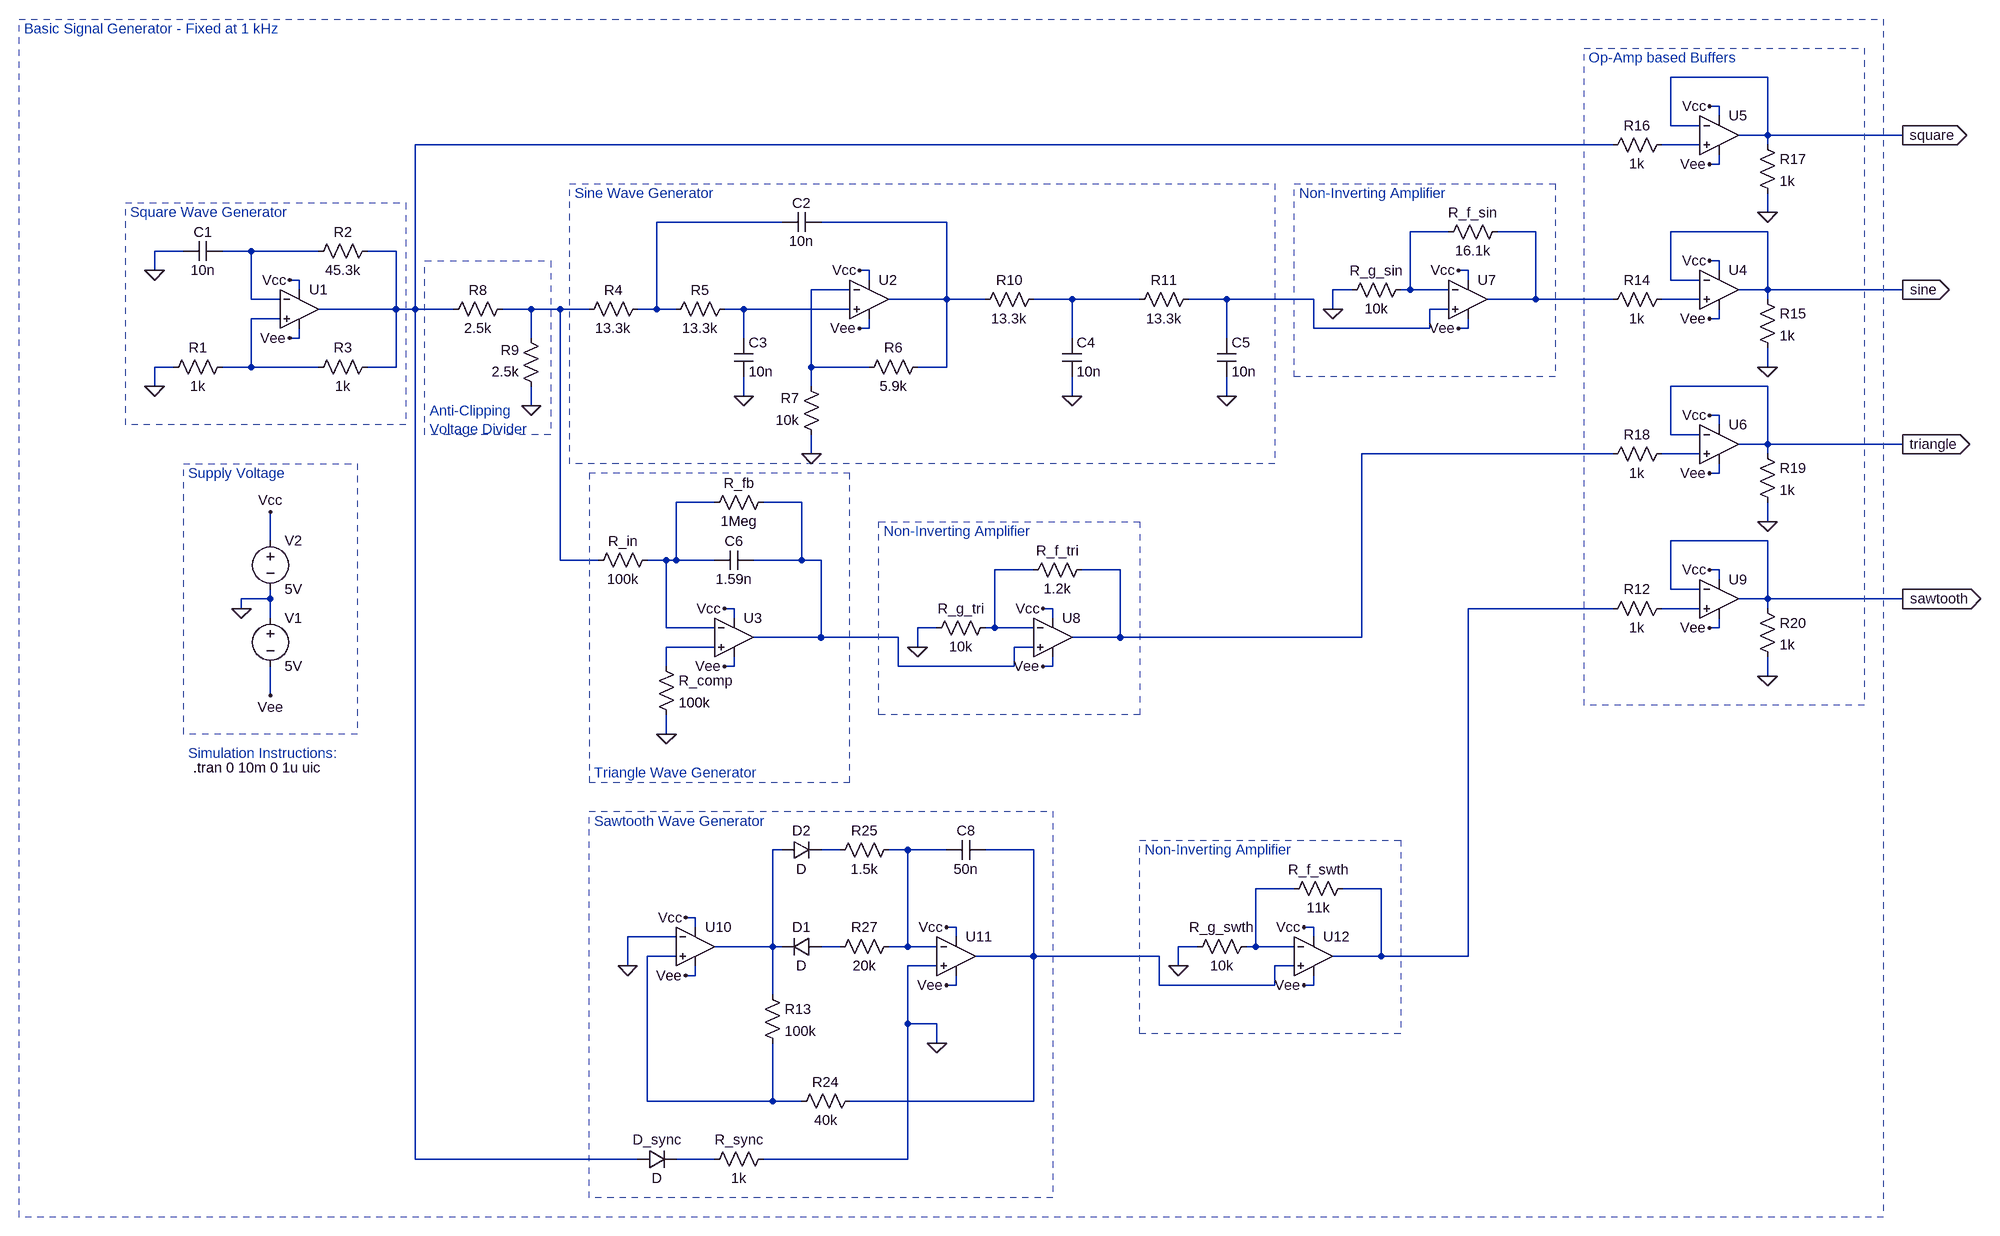
[diagram p0: schematic multi-wave-osc.asc]
multi-wave-osc.asc, the LTspice schematic file:
Version 4
SHEET 1 3000 2516
WIRE 2608 -192 2448 -192
WIRE 2528 -144 2512 -144
WIRE 2528 -128 2528 -144
WIRE 2448 -112 2448 -192
WIRE 2496 -112 2448 -112
WIRE 2608 -96 2608 -192
WIRE 2608 -96 2560 -96
WIRE 2832 -96 2608 -96
WIRE 2352 -80 368 -80
WIRE 2496 -80 2432 -80
WIRE 2608 -80 2608 -96
WIRE 2528 -48 2528 -64
WIRE 2528 -48 2512 -48
WIRE 2608 32 2608 0
WIRE 976 48 768 48
WIRE 1248 48 1040 48
WIRE 2080 64 2016 64
WIRE 2224 64 2160 64
WIRE 2608 64 2448 64
WIRE -16 96 -64 96
WIRE 96 96 48 96
WIRE 208 96 96 96
WIRE 336 96 288 96
WIRE 2528 112 2512 112
WIRE -64 128 -64 96
WIRE 1120 128 1104 128
WIRE 2112 128 2096 128
WIRE 2528 128 2528 112
WIRE 176 144 160 144
WIRE 1120 144 1120 128
WIRE 2112 144 2112 128
WIRE 2448 144 2448 64
WIRE 2496 144 2448 144
WIRE 176 160 176 144
WIRE 1088 160 1024 160
WIRE 1920 160 1888 160
WIRE 2016 160 2016 64
WIRE 2016 160 2000 160
WIRE 2080 160 2016 160
WIRE 2608 160 2608 64
WIRE 2608 160 2560 160
WIRE 2832 160 2608 160
WIRE 96 176 96 96
WIRE 144 176 96 176
WIRE 1248 176 1248 48
WIRE 1248 176 1152 176
WIRE 1312 176 1248 176
WIRE 1456 176 1392 176
WIRE 1568 176 1456 176
WIRE 1712 176 1648 176
WIRE 1856 176 1712 176
WIRE 2224 176 2224 64
WIRE 2224 176 2144 176
WIRE 2352 176 2224 176
WIRE 2496 176 2432 176
WIRE 2608 176 2608 160
WIRE 336 192 336 96
WIRE 336 192 208 192
WIRE 368 192 368 -80
WIRE 368 192 336 192
WIRE 432 192 368 192
WIRE 560 192 512 192
WIRE 608 192 560 192
WIRE 656 192 608 192
WIRE 768 192 768 48
WIRE 768 192 736 192
WIRE 800 192 768 192
WIRE 912 192 880 192
WIRE 1088 192 912 192
WIRE 1888 192 1888 160
WIRE 2080 192 2048 192
WIRE 144 208 96 208
WIRE 2528 208 2528 192
WIRE 2528 208 2512 208
WIRE 1120 224 1120 208
WIRE 1120 224 1104 224
WIRE 1856 224 1856 176
WIRE 2048 224 2048 192
WIRE 2048 224 1856 224
WIRE 2112 224 2112 208
WIRE 2112 224 2096 224
WIRE 176 240 176 224
WIRE 176 240 160 240
WIRE 560 240 560 192
WIRE 912 240 912 192
WIRE 1456 240 1456 176
WIRE 1712 240 1712 176
WIRE -32 288 -64 288
WIRE 96 288 96 208
WIRE 96 288 48 288
WIRE 208 288 96 288
WIRE 336 288 336 192
WIRE 336 288 288 288
WIRE 1024 288 1024 160
WIRE 1120 288 1024 288
WIRE 1248 288 1248 176
WIRE 1248 288 1200 288
WIRE 2608 288 2608 256
WIRE -64 320 -64 288
WIRE 1024 320 1024 288
WIRE 2608 320 2448 320
WIRE 912 336 912 304
WIRE 1456 336 1456 304
WIRE 1712 336 1712 304
WIRE 560 352 560 320
WIRE 2528 368 2512 368
WIRE 2528 384 2528 368
WIRE 2448 400 2448 320
WIRE 2496 400 2448 400
WIRE 2608 416 2608 320
WIRE 2608 416 2560 416
WIRE 2832 416 2608 416
WIRE 1024 432 1024 400
WIRE 2352 432 1936 432
WIRE 2496 432 2432 432
WIRE 2608 432 2608 416
WIRE 2528 464 2528 448
WIRE 2528 464 2512 464
WIRE 864 512 800 512
WIRE 1008 512 944 512
WIRE 2608 544 2608 512
WIRE 128 576 128 528
WIRE 2608 576 2448 576
WIRE 608 608 608 192
WIRE 672 608 608 608
WIRE 784 608 752 608
WIRE 800 608 800 512
WIRE 800 608 784 608
WIRE 864 608 800 608
WIRE 1008 608 1008 512
WIRE 1008 608 928 608
WIRE 1040 608 1008 608
WIRE 1392 624 1328 624
WIRE 1536 624 1472 624
WIRE 2528 624 2512 624
WIRE 2528 640 2528 624
WIRE 2448 656 2448 576
WIRE 2496 656 2448 656
WIRE 128 672 128 656
WIRE 128 672 80 672
WIRE 2608 672 2608 576
WIRE 2608 672 2560 672
WIRE 2832 672 2608 672
WIRE 80 688 80 672
WIRE 896 688 880 688
WIRE 1424 688 1408 688
WIRE 2352 688 2112 688
WIRE 2496 688 2432 688
WIRE 2608 688 2608 672
WIRE 128 704 128 672
WIRE 896 704 896 688
WIRE 1424 704 1424 688
WIRE 784 720 784 608
WIRE 864 720 784 720
WIRE 1232 720 1200 720
WIRE 1328 720 1328 624
WIRE 1328 720 1312 720
WIRE 1392 720 1328 720
WIRE 2528 720 2528 704
WIRE 2528 720 2512 720
WIRE 1040 736 1040 608
WIRE 1040 736 928 736
WIRE 1168 736 1040 736
WIRE 1536 736 1536 624
WIRE 1536 736 1456 736
WIRE 1936 736 1936 432
WIRE 1936 736 1536 736
WIRE 864 752 784 752
WIRE 1200 752 1200 720
WIRE 1392 752 1360 752
WIRE 784 784 784 752
WIRE 896 784 896 768
WIRE 896 784 880 784
WIRE 1168 784 1168 736
WIRE 1360 784 1360 752
WIRE 1360 784 1168 784
WIRE 1424 784 1424 768
WIRE 1424 784 1408 784
WIRE 2608 800 2608 768
WIRE 128 832 128 784
WIRE 784 896 784 864
WIRE 976 1088 960 1088
WIRE 1072 1088 1040 1088
WIRE 1184 1088 1152 1088
WIRE 1248 1088 1184 1088
WIRE 1392 1088 1312 1088
WIRE 1824 1152 1760 1152
WIRE 1968 1152 1904 1152
WIRE 832 1200 816 1200
WIRE 832 1216 832 1200
WIRE 1264 1216 1248 1216
WIRE 1856 1216 1840 1216
WIRE 800 1232 720 1232
WIRE 1264 1232 1264 1216
WIRE 1856 1232 1856 1216
WIRE 960 1248 960 1088
WIRE 960 1248 864 1248
WIRE 976 1248 960 1248
WIRE 1072 1248 1040 1248
WIRE 1184 1248 1184 1088
WIRE 1184 1248 1152 1248
WIRE 1232 1248 1184 1248
WIRE 1664 1248 1632 1248
WIRE 1760 1248 1760 1152
WIRE 1760 1248 1744 1248
WIRE 1824 1248 1760 1248
WIRE 800 1264 752 1264
WIRE 1392 1264 1392 1088
WIRE 1392 1264 1296 1264
WIRE 1600 1264 1392 1264
WIRE 1968 1264 1968 1152
WIRE 1968 1264 1888 1264
WIRE 2112 1264 2112 688
WIRE 2112 1264 1968 1264
WIRE 720 1280 720 1232
WIRE 1232 1280 1184 1280
WIRE 1632 1280 1632 1248
WIRE 1824 1280 1792 1280
WIRE 832 1296 832 1280
WIRE 832 1296 816 1296
WIRE 1264 1312 1264 1296
WIRE 1264 1312 1248 1312
WIRE 1600 1312 1600 1264
WIRE 1792 1312 1792 1280
WIRE 1792 1312 1600 1312
WIRE 1856 1312 1856 1296
WIRE 1856 1312 1840 1312
WIRE 960 1328 960 1248
WIRE 1184 1376 1184 1280
WIRE 1232 1376 1184 1376
WIRE 1232 1408 1232 1376
WIRE 752 1504 752 1264
WIRE 960 1504 960 1408
WIRE 960 1504 752 1504
WIRE 1008 1504 960 1504
WIRE 1392 1504 1392 1264
WIRE 1392 1504 1088 1504
WIRE 368 1600 368 192
WIRE 736 1600 368 1600
WIRE 864 1600 800 1600
WIRE 1184 1600 1184 1376
WIRE 1184 1600 944 1600
FLAG -64 128 0
FLAG -64 320 0
FLAG 80 688 0
FLAG 2832 -96 square
IOPIN 2832 -96 Out
FLAG 128 528 Vcc
FLAG 128 832 Vee
FLAG 160 144 Vcc
FLAG 160 240 Vee
FLAG 1104 128 Vcc
FLAG 1104 224 Vee
FLAG 1024 432 0
FLAG 912 336 0
FLAG 2832 160 sine
IOPIN 2832 160 Out
FLAG 560 352 0
FLAG 1456 336 0
FLAG 1712 336 0
FLAG 2832 416 triangle
IOPIN 2832 416 Out
FLAG 880 688 Vcc
FLAG 880 784 Vee
FLAG 2512 112 Vcc
FLAG 2512 208 Vee
FLAG 2608 288 0
FLAG 2512 -144 Vcc
FLAG 2512 -48 Vee
FLAG 2608 32 0
FLAG 2512 368 Vcc
FLAG 2512 464 Vee
FLAG 2608 544 0
FLAG 2096 128 Vcc
FLAG 2096 224 Vee
FLAG 1888 192 0
FLAG 784 896 0
FLAG 1408 688 Vcc
FLAG 1408 784 Vee
FLAG 1200 752 0
FLAG 816 1200 Vcc
FLAG 816 1296 Vee
FLAG 1248 1216 Vcc
FLAG 1248 1312 Vee
FLAG 2512 624 Vcc
FLAG 2512 720 Vee
FLAG 2608 800 0
FLAG 2832 672 sawtooth
IOPIN 2832 672 Out
FLAG 1840 1216 Vcc
FLAG 1840 1312 Vee
FLAG 1632 1280 0
FLAG 720 1280 0
FLAG 1232 1408 0
SYMBOL OpAmps\\UniversalOpamp2 176 192 R0
SYMATTR InstName U1
SYMBOL cap 48 80 R90
WINDOW 0 0 32 VBottom 2
WINDOW 3 32 32 VTop 2
SYMATTR InstName C1
SYMATTR Value 10n
SYMBOL res 64 272 R90
WINDOW 0 0 56 VBottom 2
WINDOW 3 32 56 VTop 2
SYMATTR InstName R1
SYMATTR Value 1k
SYMBOL res 304 80 R90
WINDOW 0 0 56 VBottom 2
WINDOW 3 32 56 VTop 2
SYMATTR InstName R2
SYMATTR Value 45.3k
SYMBOL res 304 272 R90
WINDOW 0 0 56 VBottom 2
WINDOW 3 32 56 VTop 2
SYMATTR InstName R3
SYMATTR Value 1k
SYMBOL voltage 128 688 R0
WINDOW 123 0 0 Left 0
WINDOW 39 0 0 Left 0
SYMATTR InstName V1
SYMATTR Value 5V
SYMBOL voltage 128 560 R0
WINDOW 123 0 0 Left 0
WINDOW 39 0 0 Left 0
SYMATTR InstName V2
SYMATTR Value 5V
SYMBOL OpAmps\\UniversalOpamp2 1120 176 R0
SYMATTR InstName U2
SYMBOL res 1216 272 R90
WINDOW 0 0 56 VBottom 2
WINDOW 3 32 56 VTop 2
SYMATTR InstName R6
SYMATTR Value 5.9k
SYMBOL res 1040 416 R180
WINDOW 0 36 76 Left 2
WINDOW 3 36 40 Left 2
SYMATTR InstName R7
SYMATTR Value 10k
SYMBOL cap 1040 32 R90
WINDOW 0 0 32 VBottom 2
WINDOW 3 32 32 VTop 2
SYMATTR InstName C2
SYMATTR Value 10n
SYMBOL cap 896 240 R0
SYMATTR InstName C3
SYMATTR Value 10n
SYMBOL res 896 176 R90
WINDOW 0 0 56 VBottom 2
WINDOW 3 32 56 VTop 2
SYMATTR InstName R5
SYMATTR Value 13.3k
SYMBOL res 752 176 R90
WINDOW 0 0 56 VBottom 2
WINDOW 3 32 56 VTop 2
SYMATTR InstName R4
SYMATTR Value 13.3k
SYMBOL res 528 176 R90
WINDOW 0 0 56 VBottom 2
WINDOW 3 32 56 VTop 2
SYMATTR InstName R8
SYMATTR Value 2.5k
SYMBOL res 576 336 R180
WINDOW 0 36 76 Left 2
WINDOW 3 36 40 Left 2
SYMATTR InstName R9
SYMATTR Value 2.5k
SYMBOL res 1408 160 R90
WINDOW 0 0 56 VBottom 2
WINDOW 3 32 56 VTop 2
SYMATTR InstName R10
SYMATTR Value 13.3k
SYMBOL cap 1440 240 R0
SYMATTR InstName C4
SYMATTR Value 10n
SYMBOL res 1664 160 R90
WINDOW 0 0 56 VBottom 2
WINDOW 3 32 56 VTop 2
SYMATTR InstName R11
SYMATTR Value 13.3k
SYMBOL cap 1696 240 R0
SYMATTR InstName C5
SYMATTR Value 10n
SYMBOL res 768 592 R90
WINDOW 0 0 56 VBottom 2
WINDOW 3 32 56 VTop 2
SYMATTR InstName R_in
SYMATTR Value 100k
SYMBOL cap 928 592 R90
WINDOW 0 0 32 VBottom 2
WINDOW 3 32 32 VTop 2
SYMATTR InstName C6
SYMATTR Value 1.59n
SYMBOL res 960 496 R90
WINDOW 0 0 56 VBottom 2
WINDOW 3 32 56 VTop 2
SYMATTR InstName R_fb
SYMATTR Value 1Meg
SYMBOL OpAmps\\UniversalOpamp2 896 736 R0
SYMATTR InstName U3
SYMBOL OpAmps\\UniversalOpamp2 2528 160 R0
SYMATTR InstName U4
SYMBOL res 2448 160 R90
WINDOW 0 0 56 VBottom 2
WINDOW 3 32 56 VTop 2
SYMATTR InstName R14
SYMATTR Value 1k
SYMBOL res 2592 160 R0
SYMATTR InstName R15
SYMATTR Value 1k
SYMBOL OpAmps\\UniversalOpamp2 2528 -96 R0
SYMATTR InstName U5
SYMBOL res 2448 -96 R90
WINDOW 0 0 56 VBottom 2
WINDOW 3 32 56 VTop 2
SYMATTR InstName R16
SYMATTR Value 1k
SYMBOL res 2592 -96 R0
SYMATTR InstName R17
SYMATTR Value 1k
SYMBOL OpAmps\\UniversalOpamp2 2528 416 R0
SYMATTR InstName U6
SYMBOL res 2448 416 R90
WINDOW 0 0 56 VBottom 2
WINDOW 3 32 56 VTop 2
SYMATTR InstName R18
SYMATTR Value 1k
SYMBOL res 2592 416 R0
SYMATTR InstName R19
SYMATTR Value 1k
SYMBOL OpAmps\\UniversalOpamp2 2112 176 R0
SYMATTR InstName U7
SYMBOL res 2176 48 R90
WINDOW 0 0 56 VBottom 2
WINDOW 3 32 56 VTop 2
SYMATTR InstName R_f_sin
SYMATTR Value 16.1k
SYMBOL res 2016 144 R90
WINDOW 0 0 56 VBottom 2
WINDOW 3 32 56 VTop 2
SYMATTR InstName R_g_sin
SYMATTR Value 10k
SYMBOL res 768 768 R0
SYMATTR InstName R_comp
SYMATTR Value 100k
SYMBOL OpAmps\\UniversalOpamp2 1424 736 R0
SYMATTR InstName U8
SYMBOL res 1488 608 R90
WINDOW 0 0 56 VBottom 2
WINDOW 3 32 56 VTop 2
SYMATTR InstName R_f_tri
SYMATTR Value 1.2k
SYMBOL res 1328 704 R90
WINDOW 0 0 56 VBottom 2
WINDOW 3 32 56 VTop 2
SYMATTR InstName R_g_tri
SYMATTR Value 10k
SYMBOL OpAmps\\UniversalOpamp2 832 1248 R0
SYMATTR InstName U10
SYMBOL OpAmps\\UniversalOpamp2 1264 1264 R0
SYMATTR InstName U11
SYMBOL diode 1040 1232 R90
WINDOW 0 0 32 VBottom 2
WINDOW 3 32 32 VTop 2
SYMATTR InstName D1
SYMBOL diode 976 1104 R270
WINDOW 0 32 32 VTop 2
WINDOW 3 0 32 VBottom 2
SYMATTR InstName D2
SYMBOL res 1168 1072 R90
WINDOW 0 0 56 VBottom 2
WINDOW 3 32 56 VTop 2
SYMATTR InstName R25
SYMATTR Value 1.5k
SYMBOL res 1168 1232 R90
WINDOW 0 0 56 VBottom 2
WINDOW 3 32 56 VTop 2
SYMATTR InstName R27
SYMATTR Value 20k
SYMBOL cap 1312 1072 R90
WINDOW 0 0 32 VBottom 2
WINDOW 3 32 32 VTop 2
SYMATTR InstName C8
SYMATTR Value 50n
SYMBOL res 944 1312 R0
SYMATTR InstName R13
SYMATTR Value 100k
SYMBOL res 1104 1488 R90
WINDOW 0 0 56 VBottom 2
WINDOW 3 32 56 VTop 2
SYMATTR InstName R24
SYMATTR Value 40k
SYMBOL OpAmps\\UniversalOpamp2 2528 672 R0
SYMATTR InstName U9
SYMBOL res 2448 672 R90
WINDOW 0 0 56 VBottom 2
WINDOW 3 32 56 VTop 2
SYMATTR InstName R12
SYMATTR Value 1k
SYMBOL res 2592 672 R0
SYMATTR InstName R20
SYMATTR Value 1k
SYMBOL OpAmps\\UniversalOpamp2 1856 1264 R0
SYMATTR InstName U12
SYMBOL res 1920 1136 R90
WINDOW 0 0 56 VBottom 2
WINDOW 3 32 56 VTop 2
SYMATTR InstName R_f_swth
SYMATTR Value 11k
SYMBOL res 1760 1232 R90
WINDOW 0 0 56 VBottom 2
WINDOW 3 32 56 VTop 2
SYMATTR InstName R_g_swth
SYMATTR Value 10k
SYMBOL res 960 1584 R90
WINDOW 0 0 56 VBottom 2
WINDOW 3 32 56 VTop 2
SYMATTR InstName R_sync
SYMATTR Value 1k
SYMBOL diode 736 1616 R270
WINDOW 0 32 32 VTop 2
WINDOW 3 0 32 VBottom 2
SYMATTR InstName D_sync
TEXT 0 952 Left 2 !.tran 0 10m 0 1u uic
TEXT -104 32 Left 2 ;Square Wave Generator
TEXT 632 0 Left 2 ;Sine Wave Generator
TEXT 664 960 Left 2 ;Triangle Wave Generator
TEXT 2312 -224 Left 2 ;Op-Amp based Buffers
TEXT 392 360 Left 2 ;Anti-Clipping \nVoltage Divider
TEXT 1832 0 Left 2 ;Non-Inverting Amplifier
TEXT 1144 560 Left 2 ;Non-Inverting Amplifier
TEXT 1576 1088 Left 2 ;Non-Inverting Amplifier
TEXT 664 1040 Left 2 ;Sawtooth Wave Generator
TEXT -280 -272 Left 2 ;Basic Signal Generator - Fixed at 1 kHz
TEXT -8 464 Left 2 ;Supply Voltage
TEXT -8 928 Left 2 ;Simulation Instructions:
RECTANGLE Normal 352 384 -112 16 2
RECTANGLE Normal 2256 304 1824 -16 2
RECTANGLE Normal 656 976 1088 464 2
RECTANGLE Normal 1568 864 1136 544 2
RECTANGLE Normal 2768 848 2304 -240 2
RECTANGLE Normal 2000 1392 1568 1072 2
RECTANGLE Normal 272 896 -16 448 2
RECTANGLE Normal 1792 448 624 -16 2
RECTANGLE Normal 592 400 384 112 2
RECTANGLE Normal 1424 1664 656 1024 2
RECTANGLE Normal 2800 1696 -288 -288 2

The netlist it stands for:
* multi-wave-osc.asc
XU1 N014 N007 Vcc Vee N001 level.2 Avol=1Meg GBW=10Meg Slew=10Meg ilimit=25m rail=0 Vos=0 phimargin=45 en=0 enk=0 in=0 ink=0 Rin=500Meg  ; pins IN+ IN- V+ V- OUT
C1 N007 0 10n
R1 N014 0 1k
R2 N001 N007 45.3k
R3 N001 N014 1k
V1 0 Vee 5V
V2 Vcc 0 5V
XU2 N013 N008 Vcc Vee N004 level.2 Avol=1Meg GBW=10Meg Slew=10Meg ilimit=25m rail=0 Vos=0 phimargin=45 en=0 enk=0 in=0 ink=0 Rin=500Meg  ; pins IN+ IN- V+ V- OUT
R6 N004 N008 5.9k
R7 0 N008 10k
C2 N004 N003 10n
C3 N013 0 10n
R5 N013 N003 13.3k
R4 N003 N012 13.3k
R8 N012 N001 2.5k
R9 0 N012 2.5k
R10 N009 N004 13.3k
C4 N009 0 10n
R11 N010 N009 13.3k
C5 N010 0 10n
R_in N017 N012 100k
C6 N018 N017 1.59n
R_fb N018 N017 1Meg
XU3 N022 N017 Vcc Vee N018 level.2 Avol=1Meg GBW=10Meg Slew=10Meg ilimit=25m rail=0 Vos=0 phimargin=45 en=0 enk=0 in=0 ink=0 Rin=500Meg  ; pins IN+ IN- V+ V- OUT
XU4 N011 sine Vcc Vee sine level.2 Avol=1Meg GBW=10Meg Slew=10Meg ilimit=25m rail=0 Vos=0 phimargin=45 en=0 enk=0 in=0 ink=0 Rin=500Meg  ; pins IN+ IN- V+ V- OUT
R14 N011 N006 1k
R15 sine 0 1k
XU5 N002 square Vcc Vee square level.2 Avol=1Meg GBW=10Meg Slew=10Meg ilimit=25m rail=0 Vos=0 phimargin=45 en=0 enk=0 in=0 ink=0 Rin=500Meg  ; pins IN+ IN- V+ V- OUT
R16 N002 N001 1k
R17 square 0 1k
XU6 N016 triangle Vcc Vee triangle level.2 Avol=1Meg GBW=10Meg Slew=10Meg ilimit=25m rail=0 Vos=0 phimargin=45 en=0 enk=0 in=0 ink=0 Rin=500Meg  ; pins IN+ IN- V+ V- OUT
R18 N016 N015 1k
R19 triangle 0 1k
XU7 N010 N005 Vcc Vee N006 level.2 Avol=1Meg GBW=10Meg Slew=10Meg ilimit=25m rail=0 Vos=0 phimargin=45 en=0 enk=0 in=0 ink=0 Rin=500Meg  ; pins IN+ IN- V+ V- OUT
R_f_sin N006 N005 16.1k
R_g_sin N005 0 10k
R_comp N022 0 100k
XU8 N018 N019 Vcc Vee N015 level.2 Avol=1Meg GBW=10Meg Slew=10Meg ilimit=25m rail=0 Vos=0 phimargin=45 en=0 enk=0 in=0 ink=0 Rin=500Meg  ; pins IN+ IN- V+ V- OUT
R_f_tri N015 N019 1.2k
R_g_tri N019 0 10k
XU10 N029 0 Vcc Vee N023 level.2 Avol=1Meg GBW=10Meg Slew=10Meg ilimit=25m rail=0 Vos=0 phimargin=45 en=0 enk=0 in=0 ink=0 Rin=500Meg  ; pins IN+ IN- V+ V- OUT
XU11 0 N025 Vcc Vee N026 level.2 Avol=1Meg GBW=10Meg Slew=10Meg ilimit=25m rail=0 Vos=0 phimargin=45 en=0 enk=0 in=0 ink=0 Rin=500Meg  ; pins IN+ IN- V+ V- OUT
D1 N028 N023 D
D2 N023 N024 D
R25 N025 N024 1.5k
R27 N025 N028 20k
C8 N026 N025 50n
R13 N023 N029 100k
R24 N026 N029 40k
XU9 N021 sawtooth Vcc Vee sawtooth level.2 Avol=1Meg GBW=10Meg Slew=10Meg ilimit=25m rail=0 Vos=0 phimargin=45 en=0 enk=0 in=0 ink=0 Rin=500Meg  ; pins IN+ IN- V+ V- OUT
R12 N021 N020 1k
R20 sawtooth 0 1k
XU12 N026 N027 Vcc Vee N020 level.2 Avol=1Meg GBW=10Meg Slew=10Meg ilimit=25m rail=0 Vos=0 phimargin=45 en=0 enk=0 in=0 ink=0 Rin=500Meg  ; pins IN+ IN- V+ V- OUT
R_f_swth N020 N027 11k
R_g_swth N027 0 10k
R_sync 0 N030 1k
D_sync N001 N030 D
.model D D
.lib standard.dio
.tran 0 10m 0 1u uic
* Square Wave Generator
* Sine Wave Generator
* Triangle Wave Generator
* Op-Amp based Buffers
* Anti-Clipping
* Voltage Divider
* Non-Inverting Amplifier
* Non-Inverting Amplifier
* Non-Inverting Amplifier
* Sawtooth Wave Generator
* Basic Signal Generator - Fixed at 1 kHz
* Supply Voltage
* Simulation Instructions:
.lib UniversalOpamps2.sub
.backanno
.end